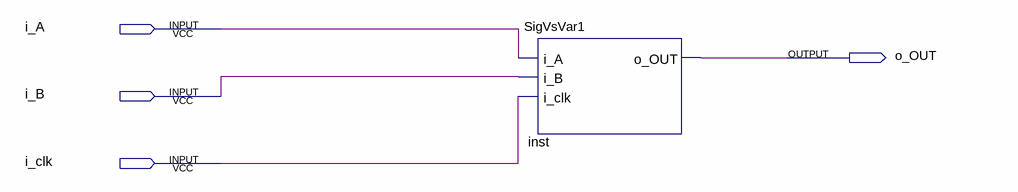
[diagram p0: schematic sheet]
// Quartus schematic Lab07_SignalsVs_Variable.bdf as structural Verilog: 1 symbols, 4 pins
module Lab07_SignalsVs_Variable (
  input  i_A,
  input  i_B,
  input  i_clk,
  output o_OUT
);

  SigVsVar1 inst (.i_A(i_A), .i_B(i_B), .i_clk(i_clk), .o_OUT(o_OUT));
endmodule
